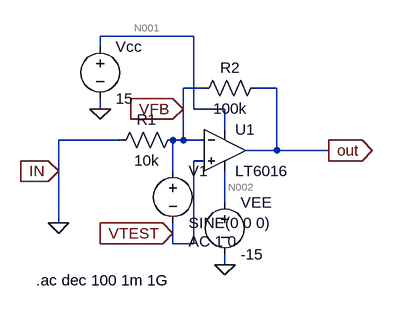
[diagram p0: schematic inverting_amp_withall.asc]
* inverting_amp_withall.asc
* U1: LT6016 (symbol OpAmps\LT6016 not available, pins judged from their places): In+=VTEST In-=VFB V+=N001 V-=N002 OUT=out
R1 VFB 0 10k
R2 out VFB 100k
Vcc N001 0 15
VEE N002 0 -15
V1 VFB VTEST SINE(0 0 0) AC 1 0
.ac dec 100 1m 1G
.backanno
.end

* Results of the author's LTspice run, read from the files saved beside the schematic
* Operating Point, zero values left out:
*   V(n002) = -15 V
*   V(n001) = 15 V
*   V(out) = -569.8 mV
*   V(vtest) = -51.83 mV
*   V(vfb) = -51.83 mV
*   I(R2) = -5.179 µA
*   I(R1) = -5.183 µA
*   I(V1) = 1.663 nA
*   I(Vee) = 344.6 µA
*   I(Vcc) = -339.5 µA
*   Ix(u1:1) = 1.663 nA
*   Ix(u1:2) = 1.663 nA
*   Ix(u1:3) = 339.5 µA
*   Ix(u1:4) = -344.6 µA
*   Ix(u1:5) = 5.179 µA
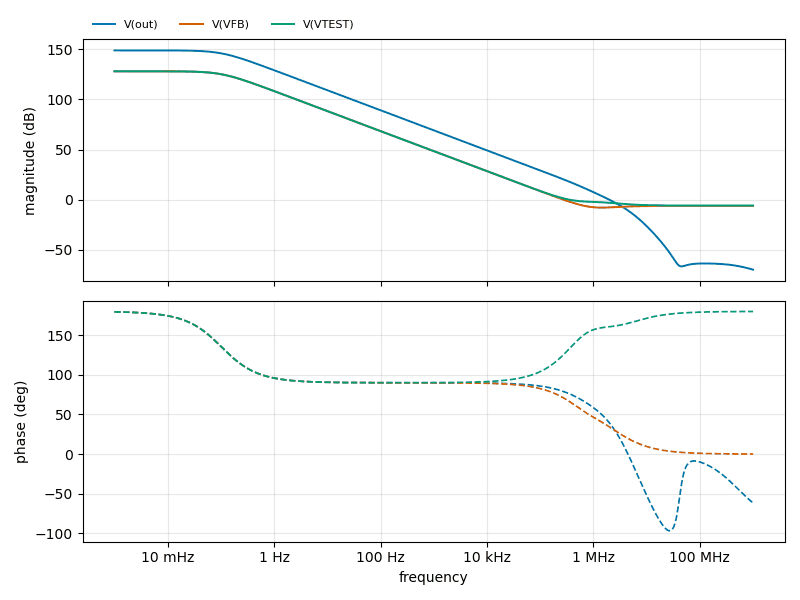
[diagram p1: AC Analysis of inverting_amp_withall.asc, plotted from the saved traces]
* AC Analysis, 1 run:
*   V(out): 148.99 dB at 1 mHz, -69.87 dB at 1 GHz, peak 148.99 dB at 1 mHz, 3 dB below the peak at 103.2 mHz
*   V(VFB): 128.16 dB at 1 mHz, -6.26 dB at 1 GHz, peak 128.16 dB at 1 mHz, 3 dB below the peak at 103.2 mHz
*   V(VTEST): 128.16 dB at 1 mHz, -5.79 dB at 1 GHz, peak 128.16 dB at 1 mHz, 3 dB below the peak at 103.2 mHz